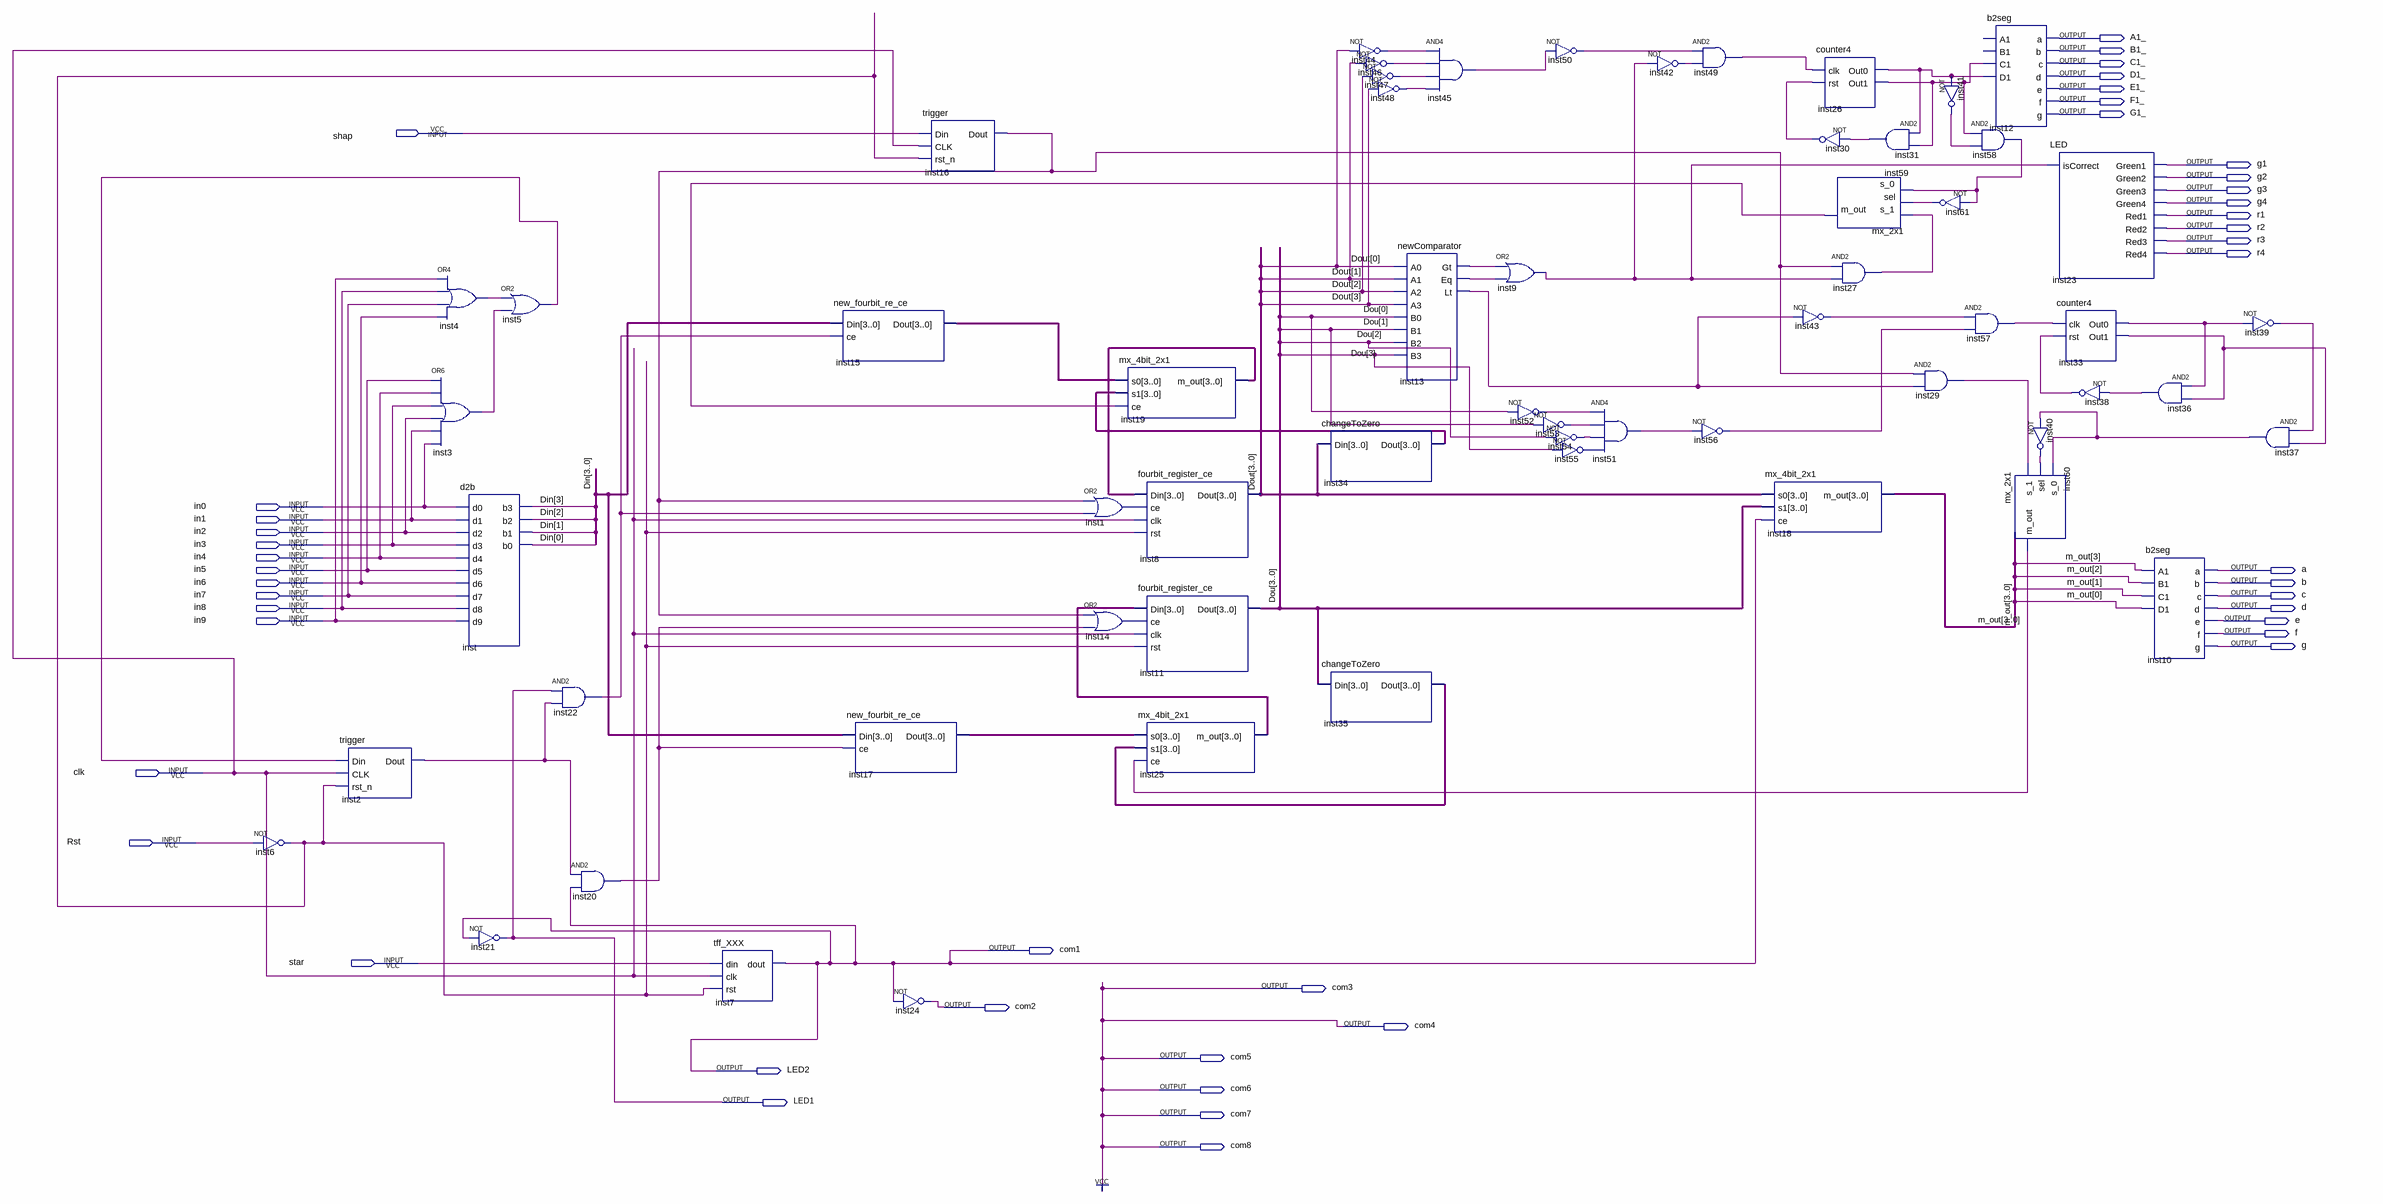
[diagram p0: schematic sheet]
// Quartus schematic traffic.bdf as structural Verilog: 60 symbols, 46 pins
module traffic (
  input  shap,
  input  in0,
  input  in1,
  input  in2,
  input  in3,
  input  in4,
  input  in5,
  input  in6,
  input  in7,
  input  in8,
  input  in9,
  input  clk,
  input  Rst,
  input  star,
  output A1_,
  output B1_,
  output C1_,
  output D1_,
  output E1_,
  output F1_,
  output G1_,
  output g1,
  output g2,
  output g3,
  output g4,
  output r1,
  output r2,
  output r3,
  output r4,
  output a,
  output b,
  output c,
  output d,
  output e,
  output f,
  output g,
  output com1,
  output com3,
  output com2,
  output com4,
  output com5,
  output LED2,
  output com6,
  output LED1,
  output com7,
  output com8
);

  wire inst1_out, inst2_dout, inst3_out, inst4_out, inst5_out, inst6_out, inst9_out, inst13_eq, inst13_gt,
       inst13_lt, inst14_out, inst16_dout, inst20_out, inst22_out, inst26_out0, inst26_out1, inst27_out,
       inst29_out, inst30_out, inst31_out, inst33_out0, inst33_out1, inst36_out, inst37_out, inst38_out,
       inst39_out, inst40_out, inst41_out, inst42_out, inst43_out, inst44_out, inst45_out, inst46_out,
       inst47_out, inst48_out, inst49_out, inst50_out, inst51_out, inst52_out, inst53_out, inst54_out,
       inst55_out, inst56_out, inst57_out, inst58_out, inst59_m_out, inst60_m_out, inst61_out;
  wire [3:0] Din, Dou, Dout, inst15_dout, inst17_dout, inst19_m_out, inst25_m_out, inst34_dout, inst35_dout,
       m_out;

  not inst6 (inst6_out, Rst);
  trigger inst2 (.Din(inst5_out), .CLK(clk), .rst_n(inst6_out), .Dout(inst2_dout));
  or inst3 (inst3_out, in5, in4, in3, in2, in1, in0);
  or inst4 (inst4_out, in9, in8, in7, in6);
  d2b inst (
    .d0(in0), .d1(in1), .d2(in2), .d3(in3), .d4(in4), .d5(in5), .d6(in6), .d7(in7), .d8(in8), .d9(in9),
    .b3(Din[3]), .b2(Din[2]), .b1(Din[1]), .b0(Din[0]));
  not inst21 (LED1, com1);
  or inst5 (inst5_out, inst4_out, inst3_out);
  and inst22 (inst22_out, LED1, inst2_dout);
  and inst20 (inst20_out, inst2_dout, com1);
  tff_XXX inst7 (.din(star), .clk(clk), .rst(inst6_out), .dout(com1));
  new_fourbit_re_ce inst15 (.Din(Din), .ce(inst22_out), .Dout(inst15_dout));
  new_fourbit_re_ce inst17 (.Din(Din), .ce(inst20_out), .Dout(inst17_dout));
  trigger inst16 (.Din(shap), .CLK(clk), .rst_n(inst6_out), .Dout(inst16_dout));
  not inst24 (com2, com1);
  or inst1 (inst1_out, inst16_dout, inst22_out);
  or inst14 (inst14_out, inst16_dout, inst20_out);
  mx_4bit_2x1 inst19 (.s0(inst15_dout), .s1(inst34_dout), .ce(inst59_m_out), .m_out(inst19_m_out));
  fourbit_register_ce inst8 (.Din(inst19_m_out), .ce(inst1_out), .clk(clk), .rst(inst6_out), .Dout(Dout));
  fourbit_register_ce inst11 (.Din(inst25_m_out), .ce(inst14_out), .clk(clk), .rst(inst6_out), .Dout(Dou));
  mx_4bit_2x1 inst25 (.s0(inst17_dout), .s1(inst35_dout), .ce(inst60_m_out), .m_out(inst25_m_out));
  changeToZero inst34 (.Din(Dout), .Dout(inst34_dout));
  changeToZero inst35 (.Din(Dou), .Dout(inst35_dout));
  not inst44 (inst44_out, Dout[0]);
  not inst46 (inst46_out, Dout[1]);
  not inst47 (inst47_out, Dout[2]);
  not inst48 (inst48_out, Dout[3]);
  newComparator inst13 (
    .A0(Dout[0]), .A1(Dout[1]), .A2(Dout[2]), .A3(Dout[3]), .B0(Dou[0]), .B1(Dou[1]), .B2(Dou[2]),
    .B3(Dou[3]), .Gt(inst13_gt), .Eq(inst13_eq), .Lt(inst13_lt));
  and inst45 (inst45_out, inst44_out, inst46_out, inst47_out, inst48_out);
  or inst9 (inst9_out, inst13_gt, inst13_eq);
  not inst50 (inst50_out, inst45_out);
  not inst52 (inst52_out, Dou[0]);
  not inst53 (inst53_out, Dou[1]);
  not inst54 (inst54_out, Dou[2]);
  and inst51 (inst51_out, inst52_out, inst53_out, inst54_out, inst55_out);
  not inst55 (inst55_out, Dou[3]);
  not inst42 (inst42_out, inst9_out);
  and inst49 (inst49_out, inst50_out, inst42_out);
  not inst56 (inst56_out, inst51_out);
  not inst43 (inst43_out, inst13_lt);
  mx_4bit_2x1 inst18 (.s0(Dout), .s1(Dou), .ce(com1), .m_out(m_out));
  counter4 inst26 (.clk(inst49_out), .rst(inst30_out), .Out0(inst26_out0), .Out1(inst26_out1));
  not inst30 (inst30_out, inst31_out);
  mx_2x1 inst59 (.s_1(inst27_out), .sel(inst61_out), .s_0(inst58_out), .m_out(inst59_m_out));
  and inst27 (inst27_out, inst16_dout, inst9_out);
  and inst31 (inst31_out, inst26_out0, inst26_out1);
  not inst41 (inst41_out, inst26_out0);
  not inst61 (inst61_out, inst58_out);
  and inst29 (inst29_out, inst16_dout, inst13_lt);
  b2seg inst12 (
    .C1(inst26_out1), .D1(inst26_out0), .a(A1_), .b(B1_), .c(C1_), .d(D1_), .e(E1_), .f(F1_), .g(G1_));  // open: A1, B1
  and inst58 (inst58_out, inst26_out1, inst41_out);
  and inst57 (inst57_out, inst43_out, inst56_out);
  mx_2x1 inst60 (.s_1(inst29_out), .sel(inst40_out), .s_0(inst37_out), .m_out(inst60_m_out));
  LED inst23 (
    .isCorrect(inst9_out), .Green1(g1), .Green2(g2), .Green3(g3), .Green4(g4), .Red1(r1), .Red2(r2),
    .Red3(r3), .Red4(r4));
  counter4 inst33 (.clk(inst57_out), .rst(inst38_out), .Out0(inst33_out0), .Out1(inst33_out1));
  not inst40 (inst40_out, inst37_out);
  not inst38 (inst38_out, inst36_out);
  and inst36 (inst36_out, inst33_out0, inst33_out1);
  b2seg inst10 (
    .A1(m_out[3]), .B1(m_out[2]), .C1(m_out[1]), .D1(m_out[0]), .a(a), .b(b), .c(c), .d(d), .e(e), .f(f),
    .g(g));
  not inst39 (inst39_out, inst33_out0);
  and inst37 (inst37_out, inst39_out, inst33_out1);

  assign com3 = 1'b1;
  assign com4 = 1'b1;
  assign com5 = 1'b1;
  assign com6 = 1'b1;
  assign com7 = 1'b1;
  assign com8 = 1'b1;
  assign LED2 = com1;
endmodule
